# Altium schematic sheet MCU.SchDoc
size A4
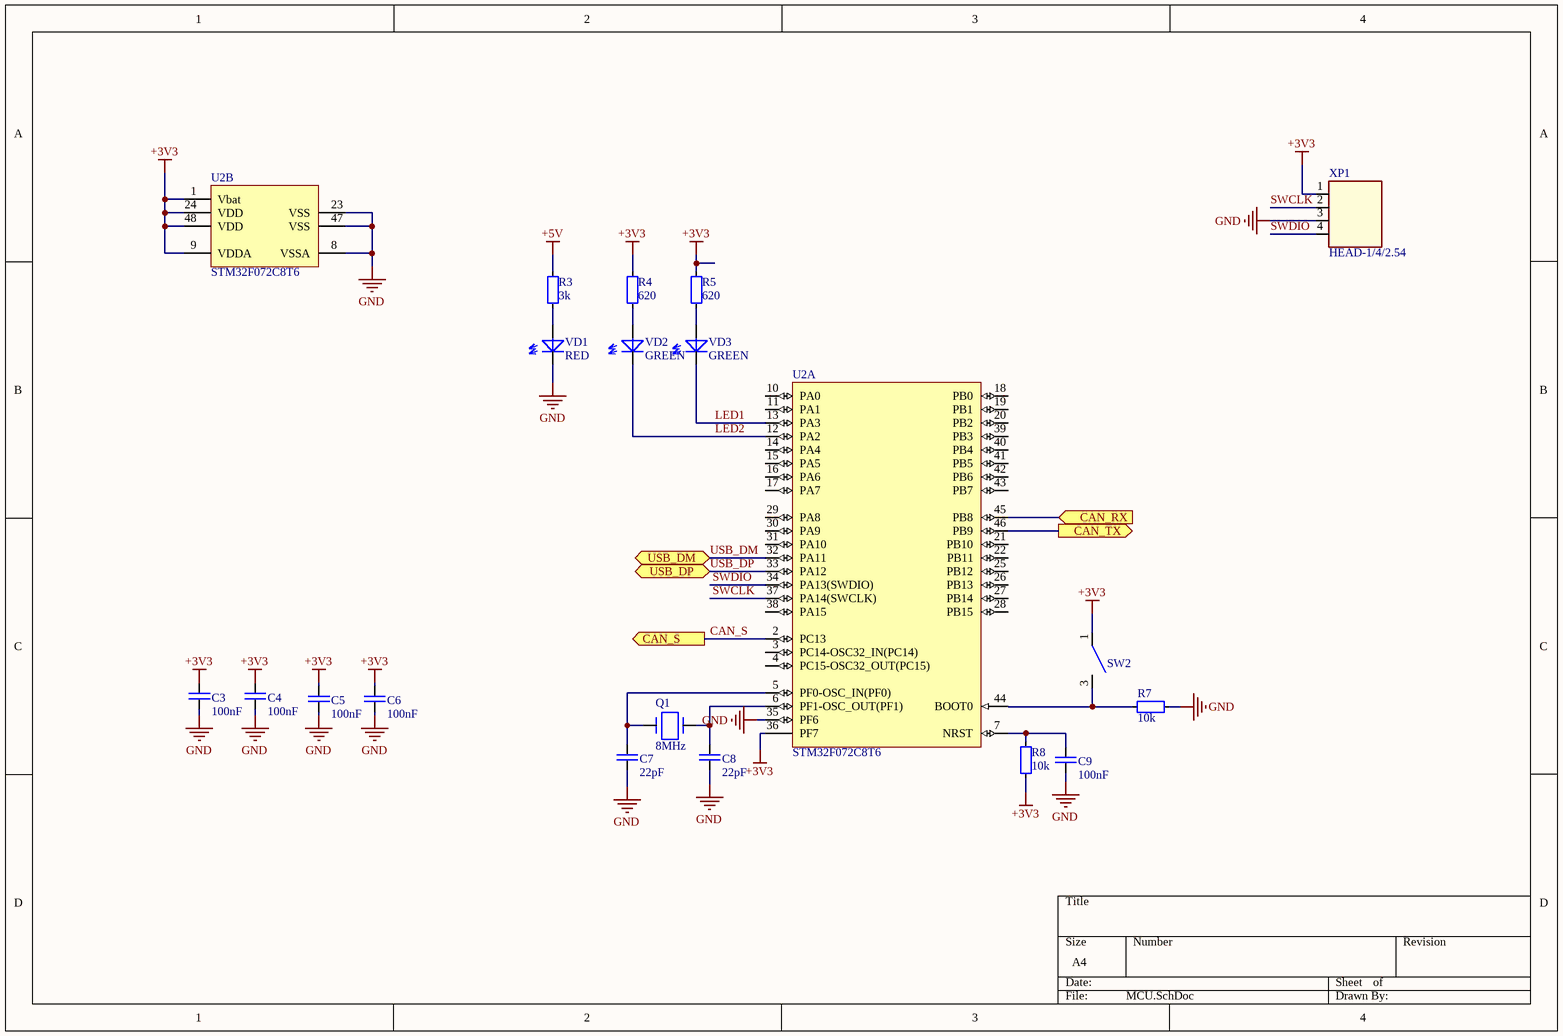
[diagram p0: MCU.SchDoc]

## Parts
C3  100nF  [SMD_0805]
C4  100nF  [SMD_0805]
C5  100nF  [SMD_0805]
C6  100nF  [SMD_0805]
C7  22pF  [SMD_0805]
C8  22pF  [SMD_0805]
C9  100nF  [SMD_0805]
Q1  8MHz  [5032-2Pin_CRYSTAL]
R3  3k  [SMD_0805]
R4  620  [SMD_0805]
R5  620  [SMD_0805]
R7  10k  [SMD_0805]
R8  10k  [SMD_0805]
SW2  SW_SMD_6/3.7  [SW_6/3.7]  (value not drawn)
U2  STM32F072C8T6  [STM-LQFP48_L]  (parts A,B of 2)
VD1  RED  [SMD_0805]
VD2  GREEN  [SMD_0805]
VD3  GREEN  [SMD_0805]
XP1  HEAD-1/4/2.54  [HEAD-1/4/2.54]

## Ports
CAN_RX (in), CAN_S (out), CAN_TX (out), USB_DM (bidir), USB_DP (bidir)

## Nets
+3V3: C3.1 C4.1 C5.1 C6.1 R4.1 R5.1 R8.2 SW2.1 U2.1(Vbat) U2.9(VDDA) U2.24(VDD) U2.36(PF7) U2.48(VDD) XP1.1
+5V: R3.1
GND: C3.2 C4.2 C5.2 C6.2 C7.2 C8.2 C9.2 R7.1 U2.8(VSSA) U2.23(VSS) U2.35(PF6) U2.47(VSS) VD1.1(C) XP1.3
CAN_RX: U2.45(PB8) ; port CAN_RX
CAN_S: U2.2(PC13) ; port CAN_S
CAN_TX: U2.46(PB9) ; port CAN_TX
LED1: U2.13(PA3) VD3.1(C)
LED2: U2.12(PA2) VD2.1(C)
SWCLK: U2.37(PA14(SWCLK)) XP1.2
SWDIO: U2.34(PA13(SWDIO)) XP1.4
USB_DM: U2.32(PA11) ; port USB_DM
USB_DP: U2.33(PA12) ; port USB_DP
NetC7_1: C7.1 Q1.1 U2.5(PF0-OSC_IN(PF0))
NetC8_1: C8.1 Q1.2 U2.6(PF1-OSC_OUT(PF1))
NetC9_1: C9.1 R8.1 U2.7(NRST)
NetR3_2: R3.2 VD1.2(A)
NetR4_2: R4.2 VD2.2(A)
NetR5_2: R5.2 VD3.2(A)
NetR7_2: R7.2 SW2.3 U2.44(BOOT0)

Not connected (* = marked no-connect by the designer): SW2 2 4; U2 3(PC14-OSC32_IN(PC14)) 4(PC15-OSC32_OUT(PC15)) 10(PA0) 11(PA1) 14(PA4) 15(PA5) 16(PA6) 17(PA7) 18(PB0) 19(PB1) 20(PB2) 21(PB10) 22(PB11) 25(PB12) 26(PB13) 27(PB14) 28(PB15) 29(PA8) 30(PA9) 31(PA10) 38(PA15) 39(PB3) 40(PB4) 41(PB5) 42(PB6) 43(PB7)

## Library data of the parts
C3-C9 = C_NONE_POLAR: None polar capacitor
  C3-C6 C9: Value: 100nF
  C7 C8: Value: 22pF
Q1 = CRYSTAL: Crystal oscillator; Value: 8MHz
R3-R5 R7 R8 = RES: Resistor
  R3: Value: 3k
  R4 R5: Value: 620
  R7 R8: Value: 10k
SW2 = SW_SMD: Manufacture: Ninigi; Model: TACT-63N-F; HelpURL: https://www.rcscomponents.kiev.ua/datasheets/tactm-idatasheet-63n.pdf
U2 = STM32F072C8T6: ARM Cortex-M0 32-bit MCU, 64 KB Flash, 8 KB Internal RAM, 39 I/Os, 48-pin LQFP, -40 to 85 degC, Tray; PartNumber: STM32F030C8T6; FLASH Size (Prog) (kB): 64; I/Os (High Current): 39; Internal RAM Size (kB): 8; Operating Frequency(F) (Processor speed) (MHz): 48; Supply Voltage(Vcc) min (V): 2.4; DatasheetVersion: Rev. 1; PackageVersion: Rev. 6, 06/2013; PackageReference: LQFP48; PackageDescription: 48-Pin Low Profile Quad Flat Package, 7 x 7 mm Body, 0.5 mm Pitch; Supplier 1: Digi-Key; Supplier Part Number 1: 497-14043-ND; Supplier 2: Newark; Supplier Part Number 2: 06X3647; Supplier 3: Mouser; Supplier Part Number 3: 511-STM32F030C8T6; Core: ARM Cortex-M0; Packing: Tray; Mounting Technology: Surface Mount; ComponentLink1Description: Manufacturer URL; ComponentLink1URL: http://www.st.com/web/en/home.html; ComponentLink2Description: Datasheet; ComponentLink2URL: http://www.st.com/st-web-ui/static/active/en/resource/technical/document/datasheet/DM00088500.pdf; ComponentLink3Description: Package Specification; ComponentLink3URL: http://www.st.com/st-web-ui/static/active/en/resource/technical/document/datasheet/DM00058181.pdf
VD1-VD3 = LED
XP1 = CON_4